# EAGLE design PJ19 (EAGLE 7.4.0)
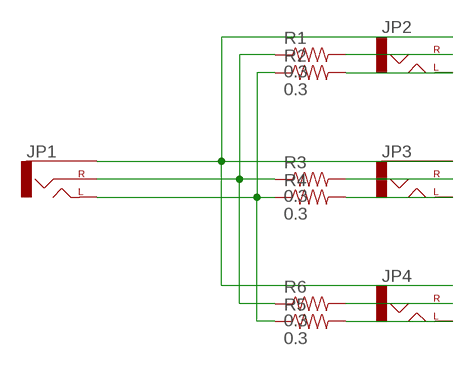
[diagram p0: schematic, sheet 1]

## Parts
JP1  AUDIO-JACKPTH  [AUDIO-JACK]
JP2  AUDIO-JACKPTH  [AUDIO-JACK]
JP3  AUDIO-JACKPTH  [AUDIO-JACK]
JP4  AUDIO-JACKPTH  [AUDIO-JACK]
R1  0.3  0.3OHM-1/8W-1%(0805)  [0805]
R2  0.3  0.3OHM-1/8W-1%(0805)  [0805]
R3  0.3  0.3OHM-1/8W-1%(0805)  [0805]
R4  0.3  0.3OHM-1/8W-1%(0805)  [0805]
R5  0.3  0.3OHM-1/8W-1%(0805)  [0805]
R6  0.3  0.3OHM-1/8W-1%(0805)  [0805]

## Nets
GND: JP1.SLEEVE JP2.SLEEVE JP3.SLEEVE JP4.SLEEVE
N$1: JP1.TIP(LEFT) R2.1 R4.1 R5.1
N$2: JP3.TIP(LEFT) R4.2
N$3: JP2.TIP(LEFT) R2.2
N$4: JP3.RING(RIGHT) R3.2
N$5: JP2.RING(RIGHT) R1.2
N$6: JP1.RING(RIGHT) R1.1 R3.1 R6.1
N$8: JP4.RING(RIGHT) R6.2
N$9: JP4.TIP(LEFT) R5.2

## Library data of the parts
JP1-JP4 = SparkFun-Connectors:AUDIO-JACK: 3.5mm Audio Jack Simple 3.5mm common PCB mount audio jack. Variant PTH is our storefront SKU PRT-08032
R1-R6 = SparkFun-Resistors:0.3OHM-1/8W-1%(0805): RES-11622; PROD_ID: RES-11622

## Board
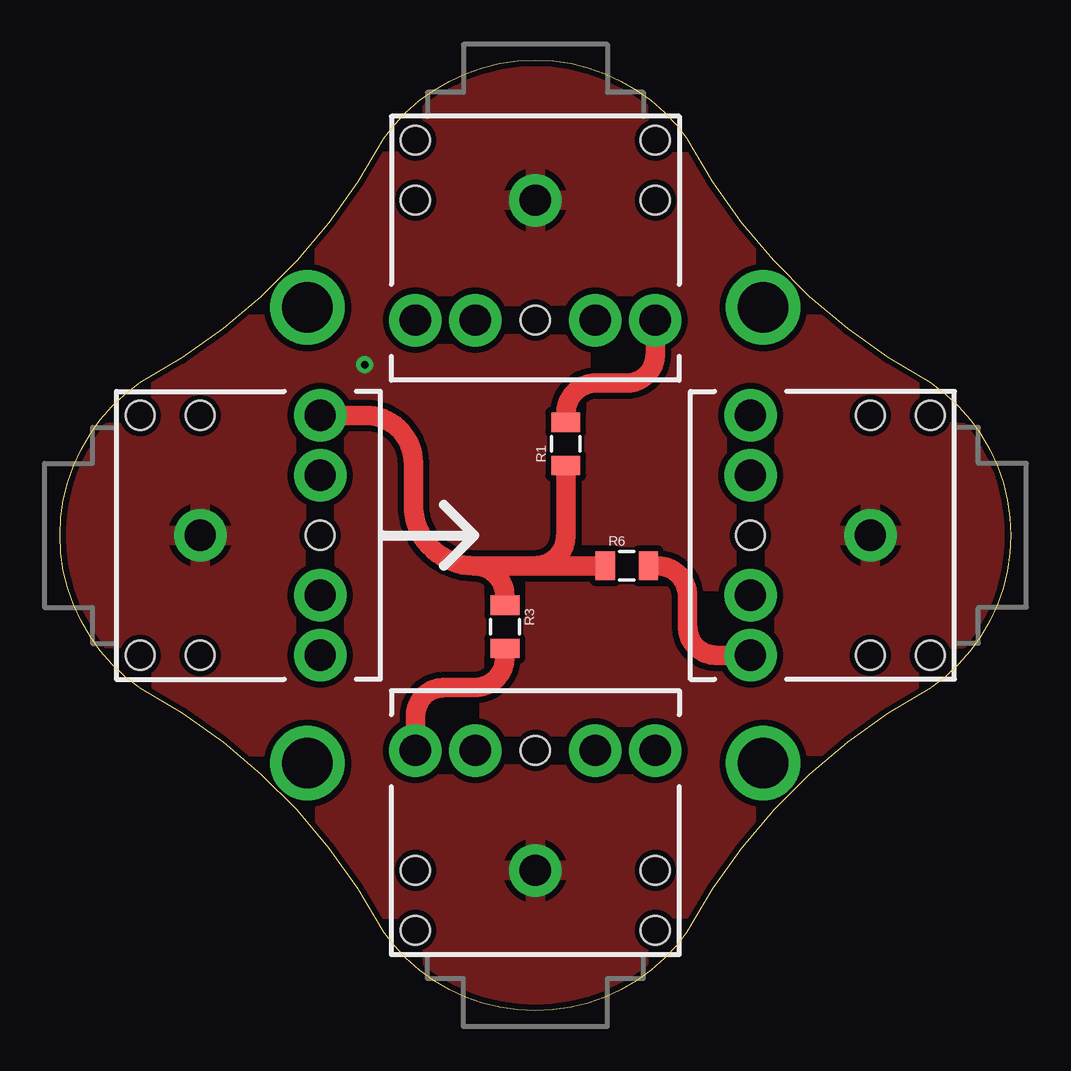
[diagram p1: board, top side]
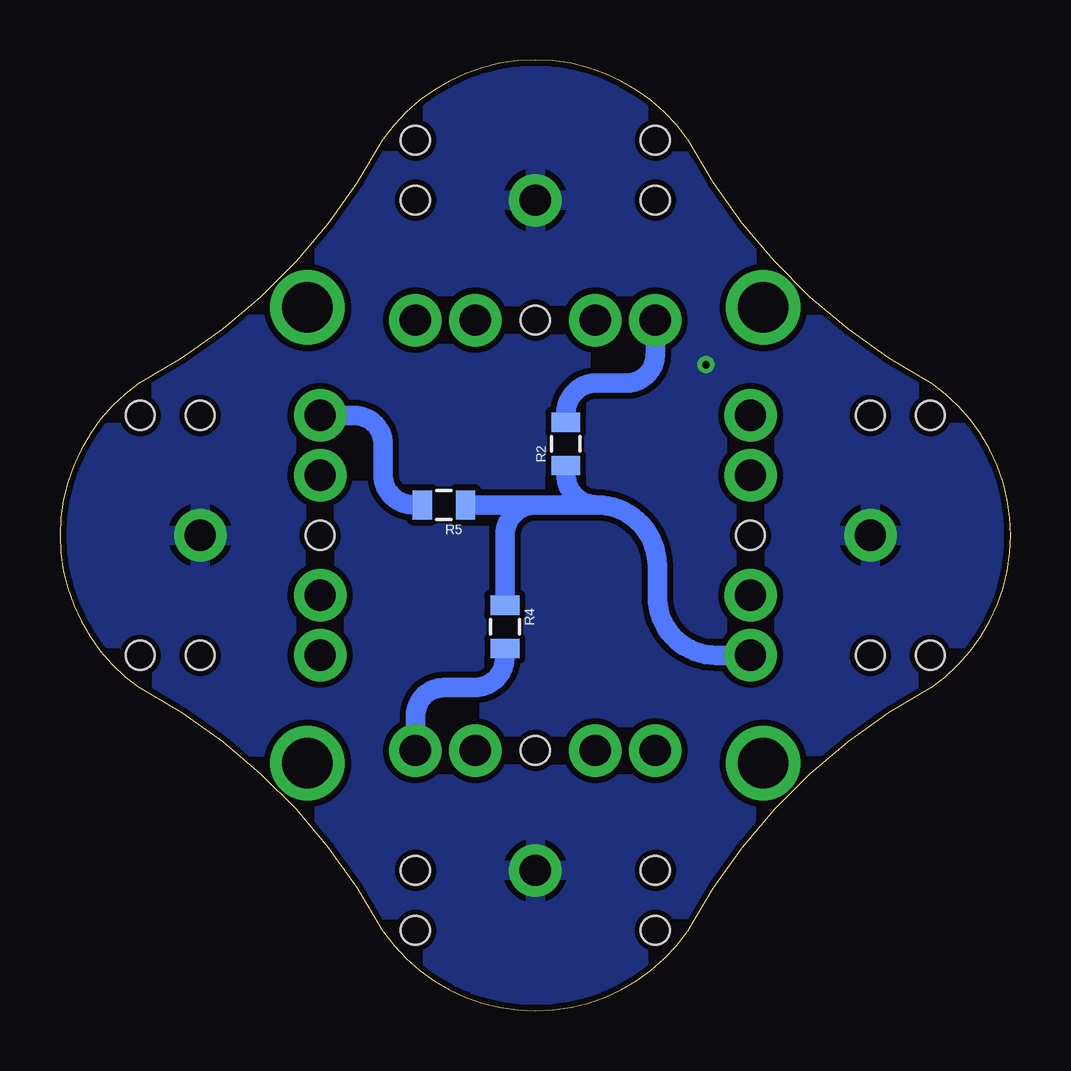
[diagram p2: board, bottom side, seen from below]

Size 39.63 x 39.63 mm. Coordinates in mm from the lower left corner, seen from the top.
Outline: 3.31,13.47 arc-34 13.47,3.31 arc110 26.17,3.31 arc-34 36.33,13.47 arc110 36.33,26.17 arc-34 26.17,36.33 arc110 13.47,36.33 arc-34 3.31,26.17 arc110 3.31,13.47
Copper layers (1*16): Top 0.035mm / dielectric 1.5mm / Bottom 0.035mm
Design rules "DRU1_SAMPLE_MRSUN_2LAYERS_1.6_FR4 *": minimum track width 8mil, minimum drill 12mil, track to track 6mil, track to pad 6mil, pad to pad 6mil, via to via 6mil, smd to smd 6mil, copper to edge 5mil, drill to drill 8mil, minimum pad ring 10mil, minimum via ring 8mil, stop-mask expansion 4mil, vias tented up to drill 24mil, thermal gap 10mil

### Footprints (pad centres in the part's own frame; a part is rotated, then mirrored left to right if it is on the bottom)
AUDIO-JACK = drill 1.3 pad 2.184: RING 5,5; RSH 5,2.5; SLEEVE 0,0; TIP 5,-5; TSH 5,-2.5 | hole 1.2: 0,5; -2.5,5; -2.5,-5; 0,-5; 5,0
0805 = smd 0.8 x 1.2: 1 -0.9,0; 2 0.9,0

### Placement (x,y rotation side)
JP1  5.85,19.82 0 top
JP2  19.82,33.79 270 top
JP3  19.82,5.85 90 top
JP4  33.79,19.82 180 top
R1  21.09,23.63 90 top
R2  18.55,23.63 90 bottom
R3  18.55,16.01 270 top
R4  21.09,16.01 270 bottom
R5  23.63,21.09 180 bottom
R6  23.63,18.55 0 top

### Tracks (layer width: path | path; a pad name or v marks a point on that pad's centre or on a via)
DR1  (via drill 2.1)
  other vias: 10.32,29.32
DR2  (via drill 2.1)
  other vias: 29.32,29.32
DR3  (via drill 2.1)
  other vias: 29.32,10.32
DR4  (via drill 2.1)
  other vias: 10.32,10.32
GND  (via drill 0.3)
  other vias: 12.7,26.93
  pour Bottom (isolate 0.254, rank 6): 13.47,36.33 16.01,38.87 19.82,40.14 23.63,38.87 26.17,36.33 29.98,31.25 36.33,26.17 38.87,23.63 40.14,19.82 38.87,16.01 36.33,13.47 31.25,9.66 29.98,8.39 26.17,3.31 23.63,0.77 19.82,-0.5 16.01,0.77 13.47,3.31 9.66,8.39 8.39,9.66 3.31,13.47 0.77,16.01 -0.5,19.82 0.77,23.63 3.31,26.17 8.39,29.98 9.66,31.25
  pour Top (isolate 0.254, rank 6): 13.47,36.33 16.01,38.87 19.82,40.14 23.63,38.87 38.87,23.63 40.14,19.82 38.87,16.01 36.33,13.47 31.25,9.66 29.98,8.39 26.17,3.31 23.63,0.77 19.82,-0.5 16.01,0.77 13.47,3.31 9.66,8.39 8.39,9.66 3.31,13.47 0.77,16.01 -0.5,19.82 0.77,23.63 3.31,26.17 8.39,29.98 9.66,31.25
N$1
  Bottom 0.813: JP1.TIP 12.28,14.82 arc90 14.74,17.28 14.74,18.55 arc-90 17.28,21.09 | 17.28,21.09 19.82,21.09 | 19.82,21.09 R5.1 | R2.1 18.55,22.36 arc-90 17.28,21.09 | R4.1 21.09,19.82 arc90 19.82,21.09
N$2
  Bottom 0.813: JP3.TIP 24.82,12.28 arc90 23.63,13.47 22.36,13.47 arc-90 21.09,14.74 R4.2
N$3
  Bottom 0.813: R2.2 18.55,24.9 arc90 17.28,26.17 16.01,26.17 arc-90 14.82,27.36 JP2.TIP
N$4
  Top 0.813: R3.2 18.55,14.74 arc-90 17.28,13.47 16.01,13.47 arc90 14.82,12.28 JP3.RING
N$5
  Top 0.813: R1.2 21.09,24.9 arc-90 22.36,26.17 23.63,26.17 arc90 24.82,27.36 JP2.RING
N$6
  Top 0.813: JP1.RING 12.74,24.82 arc-90 14.74,22.82 14.74,21.09 arc90 17.28,18.55 | 17.28,18.55 19.82,18.55 | 19.82,18.55 R6.1 | R1.1 21.09,19.82 arc-90 19.82,18.55 | R3.1 18.55,17.28 arc90 17.28,18.55
N$8
  Top 0.813: JP4.RING 27.36,14.82 arc-90 26.17,16.01 26.17,17.28 arc90 24.9,18.55 R6.2
N$9
  Bottom 0.813: JP4.TIP 27.36,24.82 arc90 26.17,23.63 26.17,22.36 arc-90 24.9,21.09 R5.2